# Altium project demo_pcb.PrjPcb
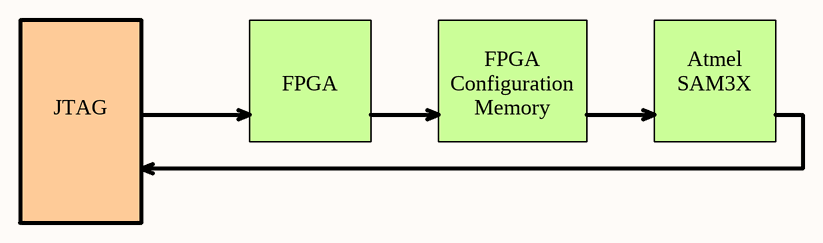
[diagram p0: Block_Diagram.SchDoc]
9 sheets, 94 parts. Net scope: flat (ports and power ports of the same name join across sheets).
Board file: demo_board.PcbDoc
Sheets:
  Block_Diagram.SchDoc
  Power_Supply_Diagram.SchDoc
  Bank0.SchDoc
  Bank1_DDR.SchDoc
  Bank2_Configuration.SchDoc
  Bank3.SchDoc
  Power.SchDoc
  Processor.SchDoc
  ADC_channel.SchDoc

## Sheet Block_Diagram.SchDoc
size A4

### Notes on the sheet
- FPGA
- FPGA
  Configuration
  Memory
- Atmel
  SAM3X
- JTAG

## Sheet Power_Supply_Diagram.SchDoc
size A4
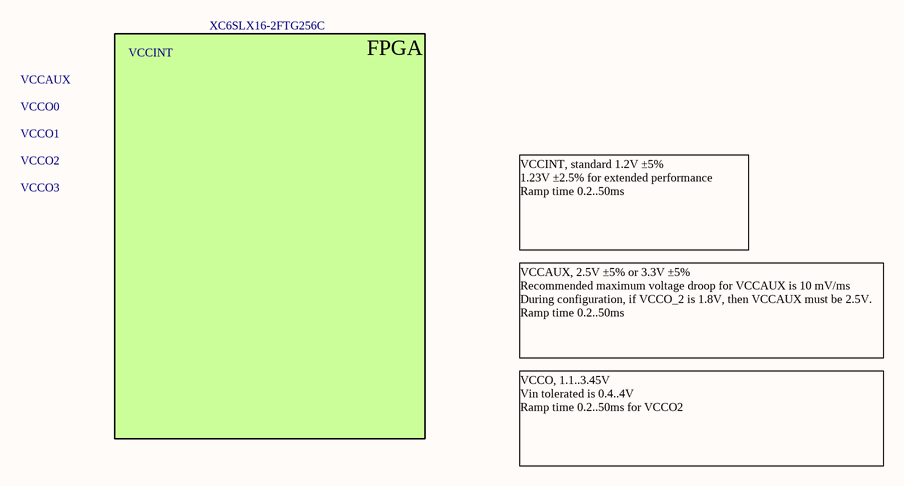
[diagram p1: Power_Supply_Diagram.SchDoc]

### Notes on the sheet
- XC6SLX16-2FTG256C
- VCCAUX
- VCCO0
- VCCINT
- VCCO1
- VCCO2
- VCCO3
- VCCINT, standard 1.2V ±5%
  1.23V ±2.5% for extended performance
  Ramp time 0.2..50ms
- VCCAUX, 2.5V ±5% or 3.3V ±5%
  Recommended maximum voltage droop for VCCAUX is 10 mV/ms
  During configuration, if VCCO_2 is 1.8V, then VCCAUX must be 2.5V.
  Ramp time 0.2..50ms
- FPGA
- VCCO, 1.1..3.45V
  Vin tolerated is 0.4..4V
  Ramp time 0.2..50ms for VCCO2

## Sheet Bank0.SchDoc
size A4
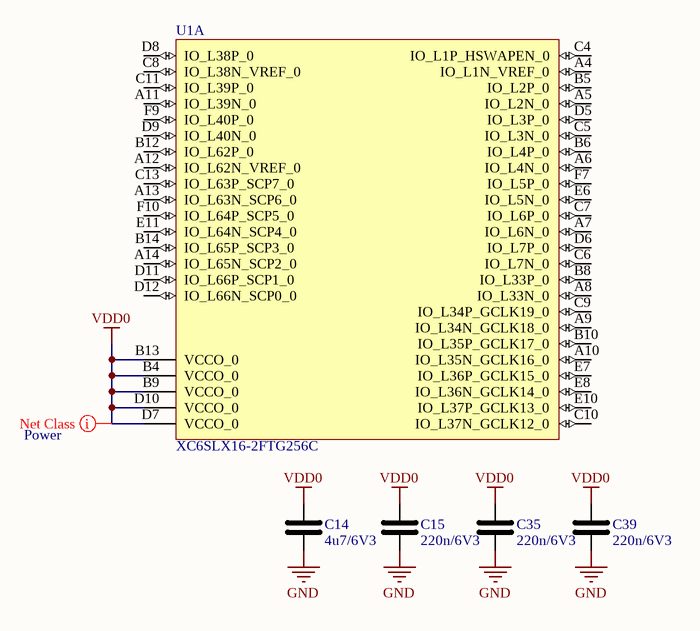
[diagram p2: Bank0.SchDoc]

### Parts
C14  4u7/6V3  [C0805_N]
C15  220n/6V3  [C0402_N]
C35  220n/6V3  [C0402_N]
C39  220n/6V3  [C0402_N]
U1  XC6SLX16-2FTG256C  [Xilinx_FT256_L]  (part A of 5)

### Nets
GND: C14.1 C15.1 C35.1 C39.1
VDD0: C14.2 C15.2 C35.2 C39.2 U1.B4(VCCO_0) U1.B9(VCCO_0) U1.B13(VCCO_0) U1.D7(VCCO_0) U1.D10(VCCO_0)

Not connected (* = marked no-connect by the designer): U1 A4(IO_L1N_VREF_0) A5(IO_L2N_0) A6(IO_L4N_0) A7(IO_L6N_0) A8(IO_L33N_0) A9(IO_L34N_GCLK18_0) A10(IO_L35N_GCLK16_0) A11(IO_L39N_0) A12(IO_L62N_VREF_0) A13(IO_L63N_SCP6_0) A14(IO_L65N_SCP2_0) B5(IO_L2P_0) B6(IO_L4P_0) B8(IO_L33P_0) B10(IO_L35P_GCLK17_0) B12(IO_L62P_0) B14(IO_L65P_SCP3_0) C4(IO_L1P_HSWAPEN_0) C5(IO_L3N_0) C6(IO_L7N_0) C7(IO_L6P_0) C8(IO_L38N_VREF_0) C9(IO_L34P_GCLK19_0) C10(IO_L37N_GCLK12_0) C11(IO_L39P_0) C13(IO_L63P_SCP7_0) D5(IO_L3P_0) D6(IO_L7P_0) D8(IO_L38P_0) D9(IO_L40N_0) D11(IO_L66P_SCP1_0) D12(IO_L66N_SCP0_0) E6(IO_L5N_0) E7(IO_L36P_GCLK15_0) E8(IO_L36N_GCLK14_0) E10(IO_L37P_GCLK13_0) E11(IO_L64N_SCP4_0) F7(IO_L5P_0) F9(IO_L40P_0) F10(IO_L64P_SCP5_0)

### Layout directives
net class Power: VDD0

### Library data of the parts
C14 C15 C35 C39 = C

## Sheet Bank1_DDR.SchDoc
size A3
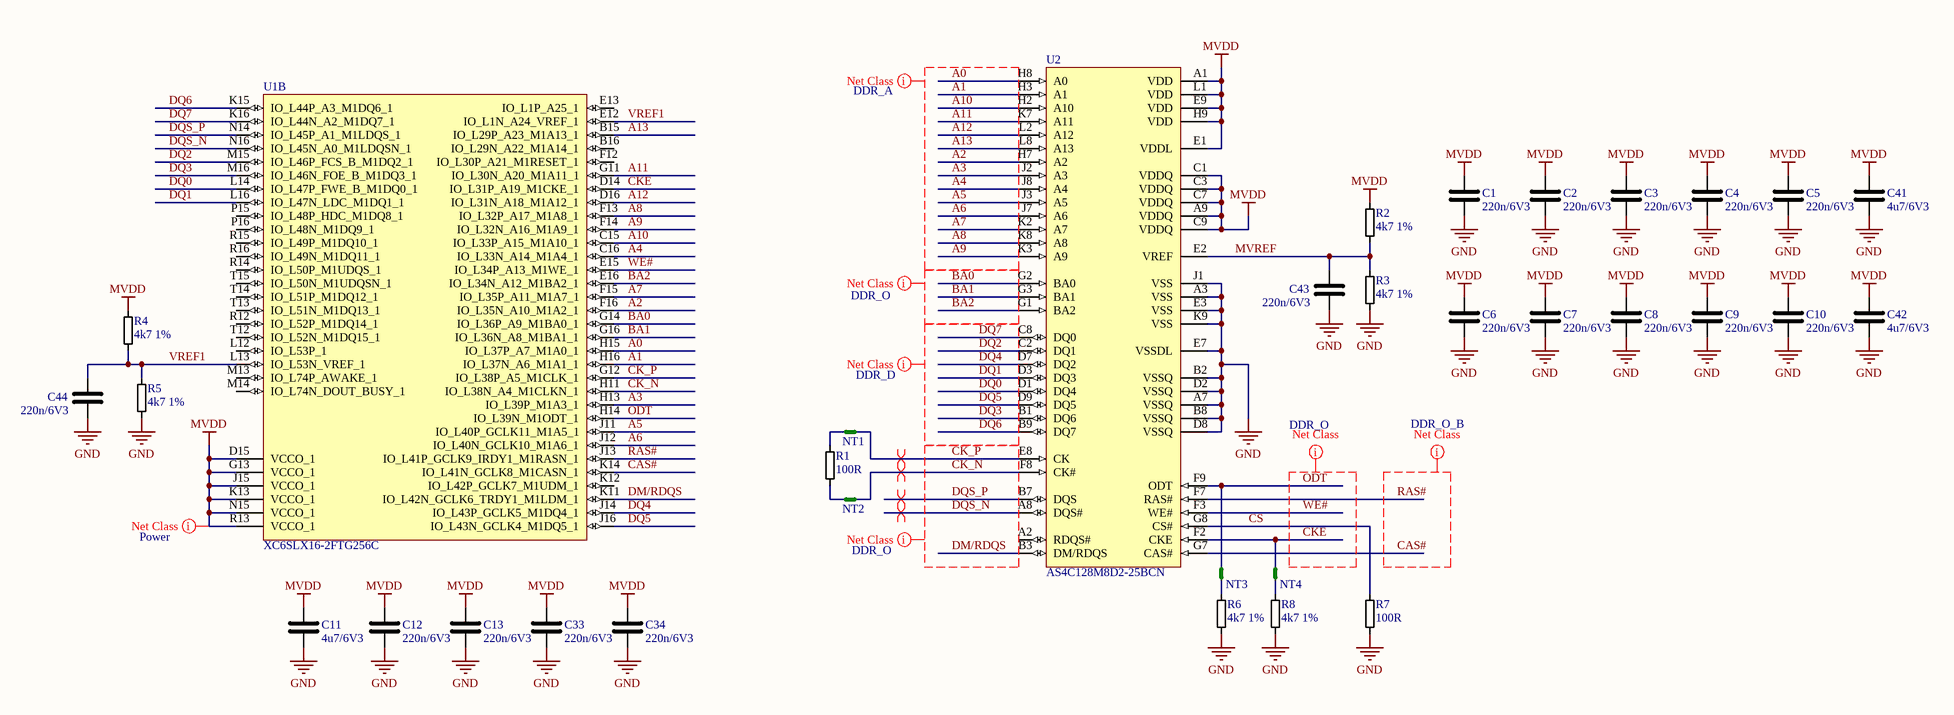
[diagram p3: Bank1_DDR.SchDoc]

### Parts
C1  220n/6V3  [C0402_N]
C2  220n/6V3  [C0402_N]
C3  220n/6V3  [C0402_N]
C4  220n/6V3  [C0402_N]
C5  220n/6V3  [C0402_N]
C6  220n/6V3  [C0402_N]
C7  220n/6V3  [C0402_N]
C8  220n/6V3  [C0402_N]
C9  220n/6V3  [C0402_N]
C10  220n/6V3  [C0402_N]
C11  4u7/6V3  [C0805_N]
C12  220n/6V3  [C0402_N]
C13  220n/6V3  [C0402_N]
C33  220n/6V3  [C0402_N]
C34  220n/6V3  [C0402_N]
C41  4u7/6V3  [C0805_N]
C42  4u7/6V3  [C0805_N]
C43  220n/6V3  [C0402_N]
C44  220n/6V3  [C0402_N]
NT1  NET TIE  [NET_TIE_5MIL_2]  (value not drawn)  (net tie, no BOM)
NT2  NET TIE  [NET_TIE_5MIL_2]  (value not drawn)  (net tie, no BOM)
NT3  NET TIE  [NET_TIE_5MIL_2]  (value not drawn)  (net tie, no BOM)
NT4  NET TIE  [NET_TIE_5MIL_2]  (value not drawn)  (net tie, no BOM)
R1  100R  [R0402_N]
R2  4k7 1%  [R0402_N]
R3  4k7 1%  [R0402_N]
R4  4k7 1%  [R0402_N]
R5  4k7 1%  [R0402_N]
R6  4k7 1%  [R0402_N]
R7  100R  [R0402_N]
R8  4k7 1%  [R0402_N]
U1  XC6SLX16-2FTG256C  [Xilinx_FT256_L]  (part B of 5)
U2  AS4C128M8D2-25BCN  [Alliance_FBGA60]

### Nets
GND: C1.1 C2.1 C3.1 C4.1 C5.1 C6.1 C7.1 C8.1 C9.1 C10.1 C11.1 C12.1 C13.1 C33.1 C34.1 C41.1 C42.1 C43.1 C44.1 R3.2 R5.2 R6.2 R7.2 R8.2 U2.A3(VSS) U2.A7(VSSQ) U2.B2(VSSQ) U2.B8(VSSQ) U2.D2(VSSQ) U2.D8(VSSQ) U2.E3(VSS) U2.E7(VSSDL) U2.J1(VSS) U2.K9(VSS)
MVDD: C1.2 C2.2 C3.2 C4.2 C5.2 C6.2 C7.2 C8.2 C9.2 C10.2 C11.2 C12.2 C13.2 C33.2 C34.2 C41.2 C42.2 R2.1 R4.1 U1.D15(VCCO_1) U1.G13(VCCO_1) U1.J15(VCCO_1) U1.K13(VCCO_1) U1.N15(VCCO_1) U1.R13(VCCO_1) U2.A1(VDD) U2.A9(VDDQ) U2.C1(VDDQ) U2.C3(VDDQ) U2.C7(VDDQ) U2.C9(VDDQ) U2.E1(VDDL) U2.E9(VDD) U2.H9(VDD) U2.L1(VDD)
A0: U1.H15(IO_L37P_A7_M1A0_1) U2.H8(A0)
A1: U1.H16(IO_L37N_A6_M1A1_1) U2.H3(A1)
A2: U1.F16(IO_L35N_A10_M1A2_1) U2.H7(A2)
A3: U1.H13(IO_L39P_M1A3_1) U2.J2(A3)
A4: U1.C16(IO_L33N_A14_M1A4_1) U2.J8(A4)
A5: U1.J11(IO_L40P_GCLK11_M1A5_1) U2.J3(A5)
A6: U1.J12(IO_L40N_GCLK10_M1A6_1) U2.J7(A6)
A7: U1.F15(IO_L35P_A11_M1A7_1) U2.K2(A7)
A8: U1.F13(IO_L32P_A17_M1A8_1) U2.K8(A8)
A9: U1.F14(IO_L32N_A16_M1A9_1) U2.K3(A9)
A10: U1.C15(IO_L33P_A15_M1A10_1) U2.H2(A10)
A11: U1.G11(IO_L30N_A20_M1A11_1) U2.K7(A11)
A12: U1.D16(IO_L31N_A18_M1A12_1) U2.L2(A12)
A13: U1.B15(IO_L29P_A23_M1A13_1) U2.L8(A13)
BA0: U1.G14(IO_L36P_A9_M1BA0_1) U2.G2(BA0)
BA1: U1.G16(IO_L36N_A8_M1BA1_1) U2.G3(BA1)
BA2: U1.E16(IO_L34N_A12_M1BA2_1) U2.G1(BA2)
CAS#: U1.K14(IO_L41N_GCLK8_M1CASN_1) U2.G7(CAS#)
CK_N: NT2.2 U1.H11(IO_L38N_A4_M1CLKN_1) U2.F8(CK#)
CK_P: NT1.2 U1.G12(IO_L38P_A5_M1CLK_1) U2.E8(CK)
CKE: NT4.2 U1.D14(IO_L31P_A19_M1CKE_1) U2.F2(CKE)
CS: R7.1 U2.G8(CS#)
DM/RDQS: U1.K11(IO_L42N_GCLK6_TRDY1_M1LDM_1) U2.B3(DM/RDQS)
DQ0: U1.L14(IO_L47P_FWE_B_M1DQ0_1) U2.D1(DQ4)
DQ1: U1.L16(IO_L47N_LDC_M1DQ1_1) U2.D3(DQ3)
DQ2: U1.M15(IO_L46P_FCS_B_M1DQ2_1) U2.C2(DQ1)
DQ3: U1.M16(IO_L46N_FOE_B_M1DQ3_1) U2.B1(DQ6)
DQ4: U1.J14(IO_L43P_GCLK5_M1DQ4_1) U2.D7(DQ2)
DQ5: U1.J16(IO_L43N_GCLK4_M1DQ5_1) U2.D9(DQ5)
DQ6: U1.K15(IO_L44P_A3_M1DQ6_1) U2.B9(DQ7)
DQ7: U1.K16(IO_L44N_A2_M1DQ7_1) U2.C8(DQ0)
DQS_N: U1.N16(IO_L45N_A0_M1LDQSN_1) U2.A8(DQS#)
DQS_P: U1.N14(IO_L45P_A1_M1LDQS_1) U2.B7(DQS)
MVREF: C43.2 R2.2 R3.1 U2.E2(VREF)
ODT: NT3.2 U1.H14(IO_L39N_M1ODT_1) U2.F9(ODT)
RAS#: U1.J13(IO_L41P_GCLK9_IRDY1_M1RASN_1) U2.F7(RAS#)
VREF1: C44.2 R4.2 R5.1 U1.E12(IO_L1N_A24_VREF_1) U1.L13(IO_L53N_VREF_1)
WE#: U1.E15(IO_L34P_A13_M1WE_1) U2.F3(WE#)
NetNT1_1: NT1.1 R1.1
NetNT2_1: NT2.1 R1.2
NetNT3_1: NT3.1 R6.1
NetNT4_1: NT4.1 R8.1

Not connected (* = marked no-connect by the designer): U1 B16(IO_L29N_A22_M1A14_1) E13(IO_L1P_A25_1) F12(IO_L30P_A21_M1RESET_1) K12(IO_L42P_GCLK7_M1UDM_1) L12(IO_L53P_1) M13(IO_L74P_AWAKE_1) M14(IO_L74N_DOUT_BUSY_1) P15(IO_L48P_HDC_M1DQ8_1) P16(IO_L48N_M1DQ9_1) R12(IO_L52P_M1DQ14_1) R14(IO_L50P_M1UDQS_1) R15(IO_L49P_M1DQ10_1) R16(IO_L49N_M1DQ11_1) T12(IO_L52N_M1DQ15_1) T13(IO_L51N_M1DQ13_1) T14(IO_L51P_M1DQ12_1) T15(IO_L50N_M1UDQSN_1); U2 A2(RDQS#)

### Layout directives
net class DDR_A: A0, A1, A2, A3, A4, A5, A6, A7, A8, A9, A10, A11, A12, A13
net class DDR_D: DQ0, DQ1, DQ2, DQ3, DQ4, DQ5, DQ6, DQ7
net class DDR_O: BA0, BA1, BA2, CK_N, CK_P, CKE, DM/RDQS, DQS_N, DQS_P, ODT, WE#
differential pair: CK_N, CK_P, DQS_N, DQS_P
net class Power: MVDD
net class DDR_O_B: CAS#, RAS#

### Library data of the parts
C1-C13 C33 C34 C41-C44 = C
R1-R8 = R

## Sheet Bank2_Configuration.SchDoc
size A4
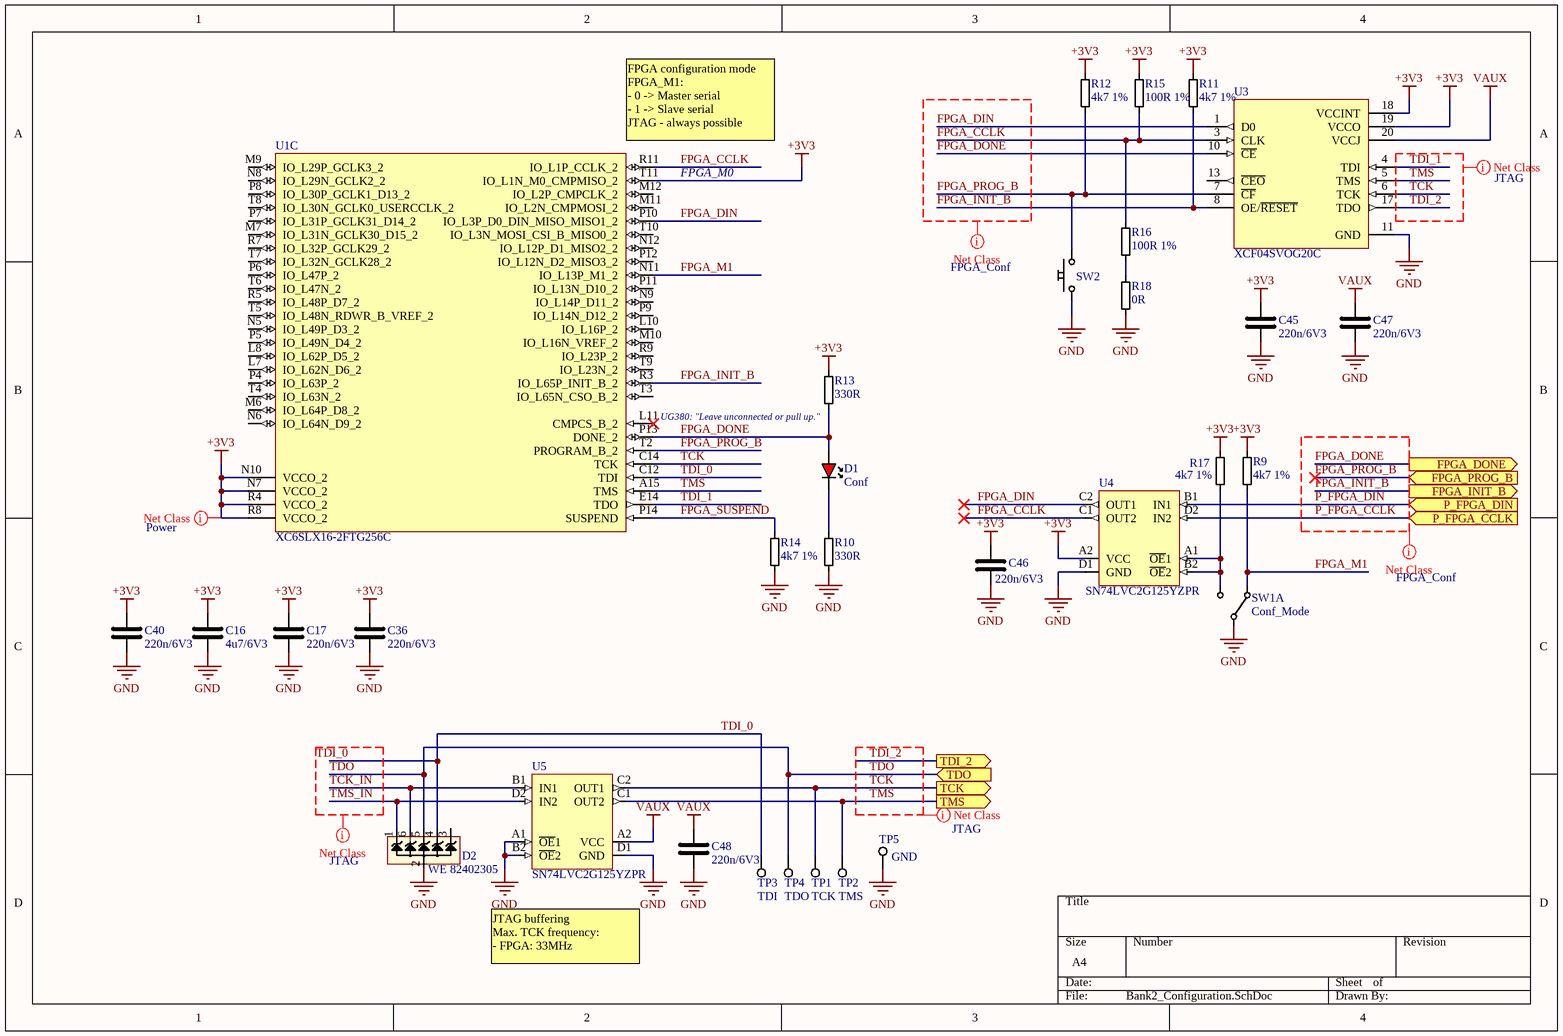
[diagram p4: Bank2_Configuration.SchDoc]

### Parts
C16  4u7/6V3  [C0805_N]
C17  220n/6V3  [C0402_N]
C36  220n/6V3  [C0402_N]
C40  220n/6V3  [C0402_N]
C45  220n/6V3  [C0402_N]
C46  220n/6V3  [C0402_N]
C47  220n/6V3  [C0402_N]
C48  220n/6V3  [C0402_N]
D1  Conf  [LED0603_red_N]
D2  WE 82402305  [SOT23-6_N]
R9  4k7 1%  [R0402_N]
R10  330R  [R0402_N]
R11  4k7 1%  [R0402_N]
R12  4k7 1%  [R0402_N]
R13  330R  [R0402_N]
R14  4k7 1%  [R0402_N]
R15  100R 1%  [R0402_N]
R16  100R 1%  [R0402_N]
R17  4k7 1%  [R0402_N]
R18  0R  [R0402_N]
SW1  Conf_Mode  [JS202011AQN]  (part A of 2)
SW2  SW 4,3mm 1,5N SMD  [SW4,3SMD]  (value not drawn)
TP1  TCK  [TP_20mil_SMT]
TP2  TMS  [TP_20mil_SMT]
TP3  TDI  [TP_20mil_SMT]
TP4  TDO  [TP_20mil_SMT]
TP5  GND  [TP_20mil_SMT]
U1  XC6SLX16-2FTG256C  [Xilinx_FT256_L]  (part C of 5)
U3  XCF04SVOG20C  [Xilinx_TSOP20_N]
U4  SN74LVC2G125YZPR  [TI_YZP8]
U5  SN74LVC2G125YZPR  [TI_YZP8]

### Ports
FPGA_DONE (out), FPGA_INIT_B (out), FPGA_PROG_B (in), P_FPGA_CCLK (in), P_FPGA_DIN (in), TCK (out), TDI_2 (out), TDO (in), TMS (out)

### Nets
+3V3: C16.2 C17.2 C36.2 C40.2 C45.2 C46.2 R9.1 R11.1 R12.1 R13.1 R15.1 R17.1 U1.N7(VCCO_2) U1.N10(VCCO_2) U1.R4(VCCO_2) U1.R8(VCCO_2) U1.T11(IO_L1N_M0_CMPMISO_2) U3.18(VCCINT) U3.19(VCCO) U4.A2(VCC)
GND: C16.1 C17.1 C36.1 C40.1 C45.1 C46.1 C47.1 C48.1 D2.2(A1) R10.2 R14.2 R18.2 SW1.COM1 SW2.1 TP5.1 U3.11(GND) U4.D1(GND) U5.A1(~{OE}1) U5.B2(~{OE}2) U5.D1(GND)
VAUX: C47.2 C48.2 U3.20(VCCJ) U5.A2(VCC)
FPGA_CCLK: R15.2 R16.1 U1.R11(IO_L1P_CCLK_2) U3.3(CLK) U4.C1(OUT2)
FPGA_DIN: U1.P10(IO_L3P_D0_DIN_MISO_MISO1_2) U3.1(D0) U4.C2(OUT1)
FPGA_DONE: D1.1 R13.2 U1.P13(DONE_2) U3.10(~{CE}) ; port FPGA_DONE
FPGA_INIT_B: R11.2 U1.R3(IO_L65P_INIT_B_2) U3.8(OE/~{RESET}) ; port FPGA_INIT_B
FPGA_M1: R9.2 SW1.NC1 U1.N11(IO_L13P_M1_2)
FPGA_PROG_B: R12.2 SW2.2 U1.T2(PROGRAM_B_2) U3.7(~{CF}) ; port FPGA_PROG_B
FPGA_SUSPEND: R14.1 U1.P14(SUSPEND)
P_FPGA_CCLK: U4.D2(IN2) ; port P_FPGA_CCLK
P_FPGA_DIN: U4.B1(IN1) ; port P_FPGA_DIN
TCK: TP1.1 U1.C14(TCK) U3.6(TCK) U5.C2(OUT1) ; port TCK
TCK_IN: D2.6(C4) U5.B1(IN1)
TDI_0: D2.4(C3) TP3.1 U1.C12(TDI)
TDI_1: U1.E14(TDO) U3.4(TDI)
TDI_2: U3.17(TDO) ; port TDI_2
TDO: D2.5(A2) TP4.1 ; port TDO
TMS: TP2.1 U1.A15(TMS) U3.5(TMS) U5.C1(OUT2) ; port TMS
TMS_IN: D2.1(C1) U5.D2(IN2)
NetD1_2: D1.2 R10.1
NetR16_2: R16.2 R18.1
NetR17_2: R17.2 SW1.NO1 U4.A1(~{OE}1) U4.B2(~{OE}2)

Not connected (* = marked no-connect by the designer): D2 3(C2); U1 L7(IO_L62N_D6_2) L8(IO_L62P_D5_2) L10(IO_L16P_2) L11(CMPCS_B_2)* M6(IO_L64P_D8_2) M7(IO_L31N_GCLK30_D15_2) M9(IO_L29P_GCLK3_2) M10(IO_L16N_VREF_2) M11(IO_L2N_CMPMOSI_2) M12(IO_L2P_CMPCLK_2) N5(IO_L49P_D3_2) N6(IO_L64N_D9_2) N8(IO_L29N_GCLK2_2) N9(IO_L14P_D11_2) N12(IO_L12P_D1_MISO2_2) P4(IO_L63P_2) P5(IO_L49N_D4_2) P6(IO_L47P_2) P7(IO_L31P_GCLK31_D14_2) P8(IO_L30P_GCLK1_D13_2) P9(IO_L14N_D12_2) P11(IO_L13N_D10_2) P12(IO_L12N_D2_MISO3_2) R5(IO_L48P_D7_2) R7(IO_L32P_GCLK29_2) R9(IO_L23P_2) T3(IO_L65N_CSO_B_2) T4(IO_L63N_2) T5(IO_L48N_RDWR_B_VREF_2) T6(IO_L47N_2) T7(IO_L32N_GCLK28_2) T8(IO_L30N_GCLK0_USERCCLK_2) T9(IO_L23N_2) T10(IO_L3N_MOSI_CSI_B_MISO0_2); U3 13(~{CEO})

### Layout directives
net class Power: +3V3
net class FPGA_Conf: FPGA_CCLK, FPGA_DIN, FPGA_DONE, FPGA_INIT_B, FPGA_PROG_B, P_FPGA_CCLK, P_FPGA_DIN
net class JTAG: TCK, TCK_IN, TDI_0, TDI_1, TDI_2, TDO, TMS, TMS_IN

### Notes on the sheet
- (near U1) FPGA configuration mode
  FPGA_M1:
  - 0 -> Master serial
  - 1 -> Slave serial
  JTAG - always possible
- FPGA_M0
- (near R13) UG380: "Leave unconnected or pull up."
- JTAG buffering
  Max. TCK frequency:
  - FPGA: 33MHz
- Labels drawn without touching a wire or pin: TDI_0

### Library data of the parts
C16 C17 C36 C40 C45-C48 = C
D1 = LED_0603_Red_Super_Bright: Generic 0603 Super Bright Red LED
D2 = WE 82402305: TVS Diode WE-TVS-Standard, VRWM=5.0V; Manufacturer 1: Wurth Elektronik; Reverse Stand Off Voltage: 5V; ComponentLink2Description: Datasheet; ComponentLink2URL: http://katalog.we-online.de/kataloge/eisos/media/pdf/82402305.pdf; Manufacturer Part Number 1: 82402305
R9-R18 = R
SW1 = JS202011AQN
SW2 = SW 4,3mm 1,5N SMD: Microswitch 4,3mm; Manufacturer Part Number 1: KSC721G LFS; Manufacturer 1: C&K Components; Supplier 1: Mouser; Supplier Part Number 1: 611-KSC721GLFS; Type: Inne
TP1-TP5 = TP
U3 = XCF04SVOG20C: Xilinx Platform Flash configuration memory 4Mbit

## Sheet Bank3.SchDoc
size A4
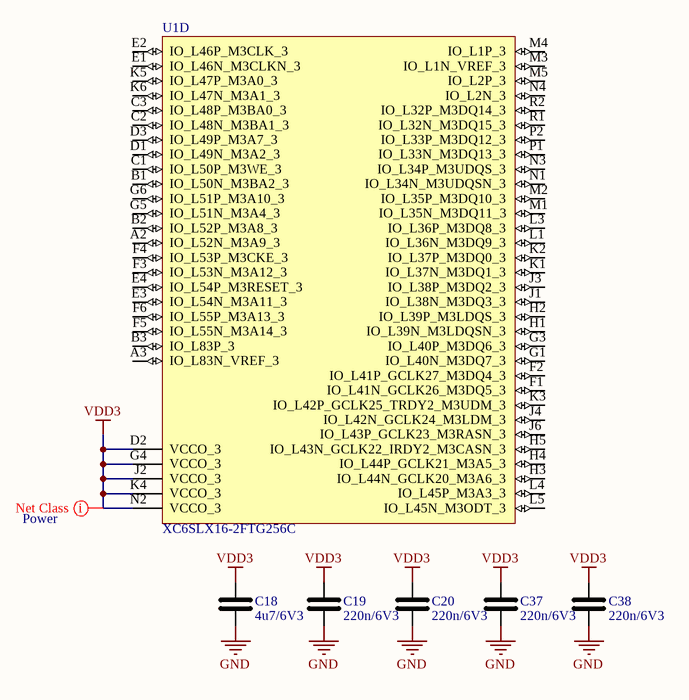
[diagram p5: Bank3.SchDoc]

### Parts
C18  4u7/6V3  [C0805_N]
C19  220n/6V3  [C0402_N]
C20  220n/6V3  [C0402_N]
C37  220n/6V3  [C0402_N]
C38  220n/6V3  [C0402_N]
U1  XC6SLX16-2FTG256C  [Xilinx_FT256_L]  (part D of 5)

### Nets
GND: C18.1 C19.1 C20.1 C37.1 C38.1
VDD3: C18.2 C19.2 C20.2 C37.2 C38.2 U1.D2(VCCO_3) U1.G4(VCCO_3) U1.J2(VCCO_3) U1.K4(VCCO_3) U1.N2(VCCO_3)

Not connected (* = marked no-connect by the designer): U1 A2(IO_L52N_M3A9_3) A3(IO_L83N_VREF_3) B1(IO_L50N_M3BA2_3) B2(IO_L52P_M3A8_3) B3(IO_L83P_3) C1(IO_L50P_M3WE_3) C2(IO_L48N_M3BA1_3) C3(IO_L48P_M3BA0_3) D1(IO_L49N_M3A2_3) D3(IO_L49P_M3A7_3) E1(IO_L46N_M3CLKN_3) E2(IO_L46P_M3CLK_3) E3(IO_L54N_M3A11_3) E4(IO_L54P_M3RESET_3) F1(IO_L41N_GCLK26_M3DQ5_3) F2(IO_L41P_GCLK27_M3DQ4_3) F3(IO_L53N_M3A12_3) F4(IO_L53P_M3CKE_3) F5(IO_L55N_M3A14_3) F6(IO_L55P_M3A13_3) G1(IO_L40N_M3DQ7_3) G3(IO_L40P_M3DQ6_3) G5(IO_L51N_M3A4_3) G6(IO_L51P_M3A10_3) H1(IO_L39N_M3LDQSN_3) H2(IO_L39P_M3LDQS_3) H3(IO_L44N_GCLK20_M3A6_3) H4(IO_L44P_GCLK21_M3A5_3) H5(IO_L43N_GCLK22_IRDY2_M3CASN_3) J1(IO_L38N_M3DQ3_3) J3(IO_L38P_M3DQ2_3) J4(IO_L42N_GCLK24_M3LDM_3) J6(IO_L43P_GCLK23_M3RASN_3) K1(IO_L37N_M3DQ1_3) K2(IO_L37P_M3DQ0_3) K3(IO_L42P_GCLK25_TRDY2_M3UDM_3) K5(IO_L47P_M3A0_3) K6(IO_L47N_M3A1_3) L1(IO_L36N_M3DQ9_3) L3(IO_L36P_M3DQ8_3) L4(IO_L45P_M3A3_3) L5(IO_L45N_M3ODT_3) M1(IO_L35N_M3DQ11_3) M2(IO_L35P_M3DQ10_3) M3(IO_L1N_VREF_3) M4(IO_L1P_3) M5(IO_L2P_3) N1(IO_L34N_M3UDQSN_3) N3(IO_L34P_M3UDQS_3) N4(IO_L2N_3) P1(IO_L33N_M3DQ13_3) P2(IO_L33P_M3DQ12_3) R1(IO_L32N_M3DQ15_3) R2(IO_L32P_M3DQ14_3)

### Layout directives
net class Power: VDD3

### Library data of the parts
C18-C20 C37 C38 = C

## Sheet Power.SchDoc
size A4
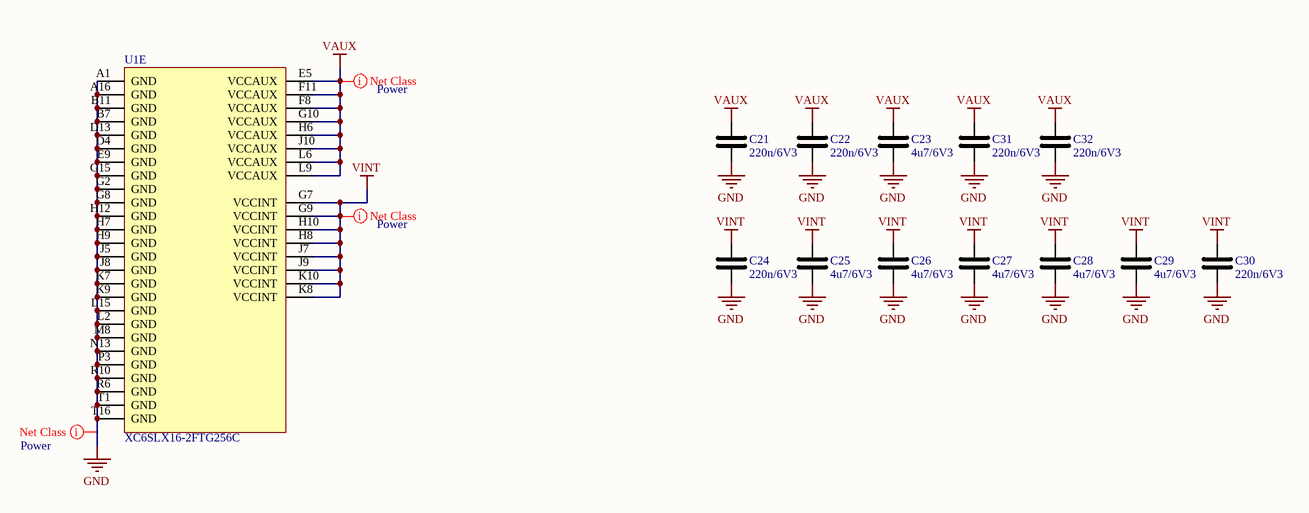
[diagram p6: Power.SchDoc]

### Parts
C21  220n/6V3  [C0402_N]
C22  220n/6V3  [C0402_N]
C23  4u7/6V3  [C0805_N]
C24  220n/6V3  [C0402_N]
C25  4u7/6V3  [C0805_N]
C26  4u7/6V3  [C0805_N]
C27  4u7/6V3  [C0805_N]
C28  4u7/6V3  [C0805_N]
C29  4u7/6V3  [C0805_N]
C30  220n/6V3  [C0402_N]
C31  220n/6V3  [C0402_N]
C32  220n/6V3  [C0402_N]
U1  XC6SLX16-2FTG256C  [Xilinx_FT256_L]  (part E of 5)

### Nets
GND: C21.1 C22.1 C23.1 C24.1 C25.1 C26.1 C27.1 C28.1 C29.1 C30.1 C31.1 C32.1 U1.A1(GND) U1.A16(GND) U1.B7(GND) U1.B11(GND) U1.D4(GND) U1.D13(GND) U1.E9(GND) U1.G2(GND) U1.G8(GND) U1.G15(GND) U1.H7(GND) U1.H9(GND) U1.H12(GND) U1.J5(GND) U1.J8(GND) U1.K7(GND) U1.K9(GND) U1.L2(GND) U1.L15(GND) U1.M8(GND) U1.N13(GND) U1.P3(GND) U1.R6(GND) U1.R10(GND) U1.T1(GND) U1.T16(GND)
VAUX: C21.2 C22.2 C23.2 C31.2 C32.2 U1.E5(VCCAUX) U1.F8(VCCAUX) U1.F11(VCCAUX) U1.G10(VCCAUX) U1.H6(VCCAUX) U1.J10(VCCAUX) U1.L6(VCCAUX) U1.L9(VCCAUX)
VINT: C24.2 C25.2 C26.2 C27.2 C28.2 C29.2 C30.2 U1.G7(VCCINT) U1.G9(VCCINT) U1.H8(VCCINT) U1.H10(VCCINT) U1.J7(VCCINT) U1.J9(VCCINT) U1.K8(VCCINT) U1.K10(VCCINT)

### Layout directives
net class Power: GND, VAUX, VINT

### Library data of the parts
C21-C32 = C

## Sheet Processor.SchDoc
size A3
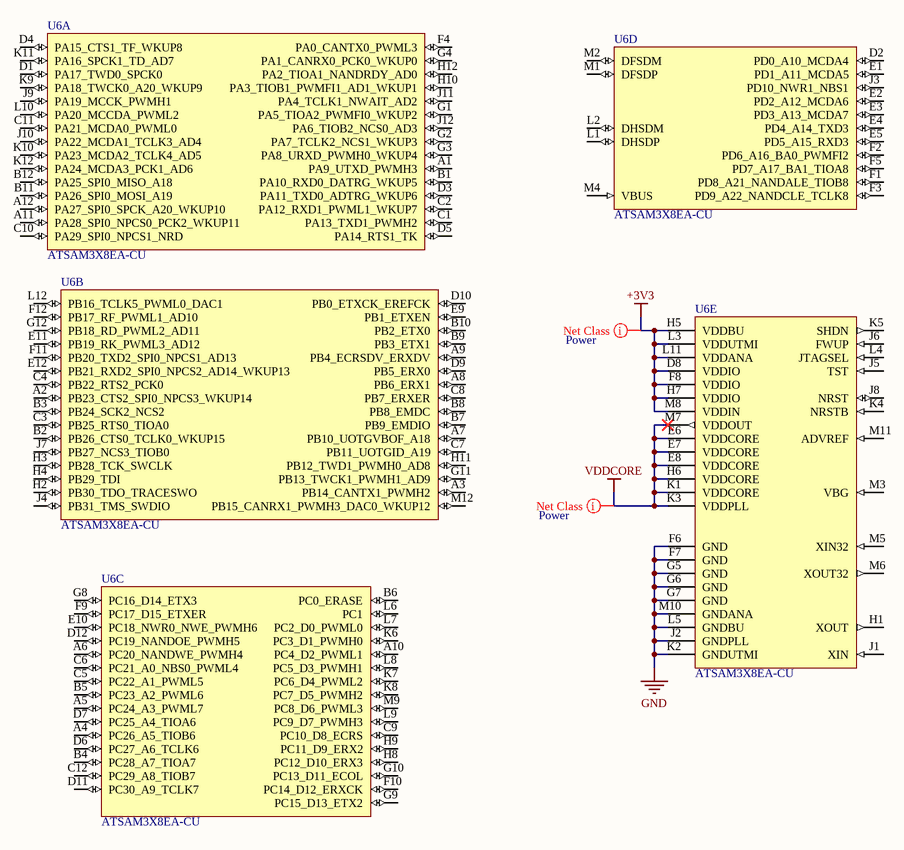
[diagram p7: Processor.SchDoc]

### Parts
U6  ATSAM3X8EA-CU  [Atmel_LFBGA144_M]  (parts A,B,C,D,E of 5)

### Nets
+3V3: U6.D8(VDDIO) U6.F8(VDDIO) U6.H5(VDDBU) U6.H7(VDDIO) U6.L3(VDDUTMI) U6.L11(VDDANA) U6.M8(VDDIN)
GND: U6.F6(GND) U6.F7(GND) U6.G5(GND) U6.G6(GND) U6.G7(GND) U6.J2(GNDPLL) U6.K2(GNDUTMI) U6.L5(GNDBU) U6.M10(GNDANA)
VDDCORE: U6.E6(VDDCORE) U6.E7(VDDCORE) U6.E8(VDDCORE) U6.H6(VDDCORE) U6.K1(VDDCORE) U6.K3(VDDPLL) U6.M7(VDDOUT)

Not connected (* = marked no-connect by the designer): U6 A1(PA9_UTXD_PWMH3) A2(PB23_CTS2_SPI0_NPCS3_WKUP14) A3(PB14_CANTX1_PWMH2) A4(PC26_A5_TIOB6) A5(PC24_A3_PWML7) A6(PC20_NANDWE_PWMH4) A7(PB10_UOTGVBOF_A18) A8(PB6_ERX1) A9(PB4_ECRSDV_ERXDV) A10(PC4_D2_PWML1) A11(PA28_SPI0_NPCS0_PCK2_WKUP11) A12(PA27_SPI0_SPCK_A20_WKUP10) B1(PA10_RXD0_DATRG_WKUP5) B2(PB26_CTS0_TCLK0_WKUP15) B3(PB24_SCK2_NCS2) B4(PC28_A7_TIOA7) B5(PC23_A2_PWML6) B6(PC0_ERASE) B7(PB9_EMDIO) B8(PB8_EMDC) B9(PB3_ETX1) B10(PB2_ETX0) B11(PA26_SPI0_MOSI_A19) B12(PA25_SPI0_MISO_A18) C1(PA13_TXD1_PWMH2) C2(PA12_RXD1_PWML1_WKUP7) C3(PB25_RTS0_TIOA0) C4(PB22_RTS2_PCK0) C5(PC22_A1_PWML5) C6(PC21_A0_NBS0_PWML4) C7(PB11_UOTGID_A19) C8(PB7_ERXER) C9(PC10_D8_ECRS) C10(PA29_SPI0_NPCS1_NRD) C11(PA21_MCDA0_PWML0) C12(PC29_A8_TIOB7) D1(PA17_TWD0_SPCK0) D2(PD0_A10_MCDA4) D3(PA11_TXD0_ADTRG_WKUP6) D4(PA15_CTS1_TF_WKUP8) D5(PA14_RTS1_TK) D6(PC27_A6_TCLK6) D7(PC25_A4_TIOA6) D9(PB5_ERX0) D10(PB0_ETXCK_EREFCK) D11(PC30_A9_TCLK7) D12(PC19_NANDOE_PWMH5) E1(PD1_A11_MCDA5) E2(PD2_A12_MCDA6) E3(PD3_A13_MCDA7) E4(PD4_A14_TXD3) E5(PD5_A15_RXD3) E9(PB1_ETXEN) E10(PC18_NWR0_NWE_PWMH6) E11(PB19_RK_PWML3_AD12) E12(PB21_RXD2_SPI0_NPCS2_AD14_WKUP13) F1(PD8_A21_NANDALE_TIOB8) F2(PD6_A16_BA0_PWMFI2) F3(PD9_A22_NANDCLE_TCLK8) F4(PA0_CANTX0_PWML3) F5(PD7_A17_BA1_TIOA8) F9(PC17_D15_ETXER) F10(PC14_D12_ERXCK) F11(PB20_TXD2_SPI0_NPCS1_AD13) F12(PB17_RF_PWML1_AD10) G1(PA5_TIOA2_PWMFI0_WKUP2) G2(PA7_TCLK2_NCS1_WKUP3) G3(PA8_URXD_PWMH0_WKUP4) G4(PA1_CANRX0_PCK0_WKUP0) G8(PC16_D14_ETX3) G9(PC15_D13_ETX2) G10(PC13_D11_ECOL) G11(PB13_TWCK1_PWMH1_AD9) G12(PB18_RD_PWML2_AD11) H1(XOUT) H2(PB30_TDO_TRACESWO) H3(PB28_TCK_SWCLK) H4(PB29_TDI) H8(PC12_D10_ERX3) H9(PC11_D9_ERX2) H10(PA3_TIOB1_PWMFI1_AD1_WKUP1) H11(PB12_TWD1_PWMH0_AD8) H12(PA2_TIOA1_NANDRDY_AD0) J1(XIN) J3(PD10_NWR1_NBS1) J4(PB31_TMS_SWDIO) J5(TST) J6(FWUP) J7(PB27_NCS3_TIOB0) J8(NRST) J9(PA19_MCCK_PWMH1) J10(PA22_MCDA1_TCLK3_AD4) J11(PA4_TCLK1_NWAIT_AD2) J12(PA6_TIOB2_NCS0_AD3) K4(NRSTB) K5(SHDN) K6(PC3_D1_PWMH0) K7(PC6_D4_PWML2) K8(PC7_D5_PWMH2) K9(PA18_TWCK0_A20_WKUP9) K10(PA23_MCDA2_TCLK4_AD5) K11(PA16_SPCK1_TD_AD7) K12(PA24_MCDA3_PCK1_AD6) L1(DHSDP) L2(DHSDM) L4(JTAGSEL) L6(PC1) L7(PC2_D0_PWML0) L8(PC5_D3_PWMH1) L9(PC9_D7_PWMH3) L10(PA20_MCCDA_PWML2) L12(PB16_TCLK5_PWML0_DAC1) M1(DFSDP) M2(DFSDM) M3(VBG) M4(VBUS) M5(XIN32) M6(XOUT32) M9(PC8_D6_PWML3) M11(ADVREF) M12(PB15_CANRX1_PWMH3_DAC0_WKUP12)

### Layout directives
net class Power: +3V3, VDDCORE

## Sheet ADC_channel.SchDoc
size A4
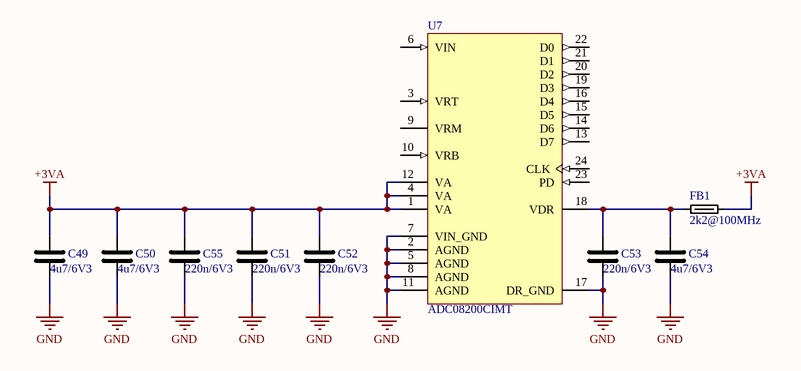
[diagram p8: ADC_channel.SchDoc]

### Parts
C49  4u7/6V3  [C0805_N]
C50  4u7/6V3  [C0805_N]
C51  220n/6V3  [C0402_N]
C52  220n/6V3  [C0402_N]
C53  220n/6V3  [C0402_N]
C54  4u7/6V3  [C0805_N]
C55  220n/6V3  [C0402_N]
FB1  value 2k2@100MHz  [L0805_N]  (hidden comment: HZ0805B222R-10)
U7  ADC08200CIMT  [National_TSSOP24_N]

### Nets
+3VA: C49.2 C50.2 C51.2 C52.2 C55.2 FB1.2 U7.1(VA) U7.4(VA) U7.12(VA)
GND: C49.1 C50.1 C51.1 C52.1 C53.1 C54.1 C55.1 U7.2(AGND) U7.5(AGND) U7.7(VIN_GND) U7.8(AGND) U7.11(AGND) U7.17(DR_GND)
NetC53_2: C53.2 C54.2 FB1.1 U7.18(VDR)

Not connected (* = marked no-connect by the designer): U7 3(VRT) 6(VIN) 9(VRM) 10(VRB) 13(D7) 14(D6) 15(D5) 16(D4) 19(D3) 20(D2) 21(D1) 22(D0) 23(PD) 24(CLK)

### Library data of the parts
C49-C55 = C
FB1 = HZ0805B222R-10: Ferrite Bead, 0805, 2200R@100MHz, 0.8R@DC, 200mA max.

## Nets that join several sheets
+3V3: Bank2_Configuration (20 pins), Processor (7 pins)
GND: Bank0 (C14.1 C15.1 C35.1 C39.1), Bank1_DDR (34 pins), Bank2_Configuration (20 pins), Bank3 (5 pins), Power (38 pins), Processor (9 pins), ADC_channel (13 pins)
VAUX: Bank2_Configuration (C47.2 C48.2 U3.20 U5.A2), Power (13 pins)

## Assembly variants
Std: all parts fitted